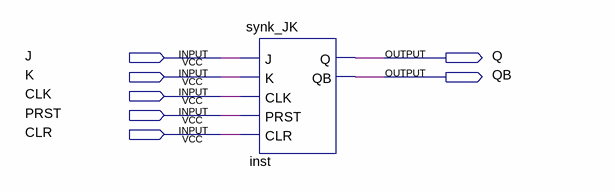
[diagram p0: schematic sheet]
// Quartus schematic Block1.bdf as structural Verilog: 1 symbols, 7 pins
module Block1 (
  input  J,
  input  K,
  input  CLK,
  input  PRST,
  input  CLR,
  output Q,
  output QB
);

  synk_JK inst (.J(J), .K(K), .CLK(CLK), .PRST(PRST), .CLR(CLR), .Q(Q), .QB(QB));
endmodule
